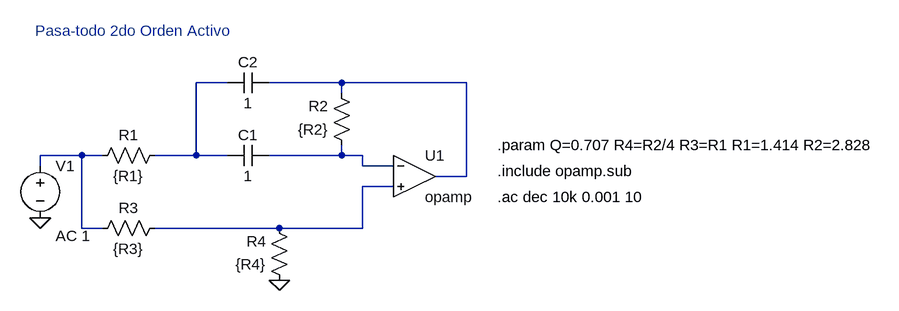
[diagram p0: schematic EJE2_C.asc]
EJE2_C.asc, the LTspice schematic file:
Version 4
SHEET 1 1232 680
WIRE 176 64 128 64
WIRE 352 64 240 64
WIRE 544 64 352 64
WIRE 352 80 352 64
WIRE -48 176 -112 176
WIRE -16 176 -48 176
WIRE 128 176 128 64
WIRE 128 176 64 176
WIRE 176 176 128 176
WIRE 352 176 352 160
WIRE 352 176 240 176
WIRE 384 176 352 176
WIRE -112 192 -112 176
WIRE 384 192 384 176
WIRE 432 192 384 192
WIRE 544 208 544 64
WIRE 544 208 496 208
WIRE 432 224 384 224
WIRE -48 288 -48 176
WIRE -16 288 -48 288
WIRE 256 288 64 288
WIRE 384 288 384 224
WIRE 384 288 256 288
FLAG 256 368 0
FLAG -112 272 0
SYMBOL res 80 160 R90
WINDOW 0 0 56 VBottom 2
WINDOW 3 32 56 VTop 2
SYMATTR InstName R1
SYMATTR Value {R1}
SYMBOL res 80 272 R90
WINDOW 0 0 56 VBottom 2
WINDOW 3 32 56 VTop 2
SYMATTR InstName R3
SYMATTR Value {R3}
SYMBOL res 272 384 R180
WINDOW 0 36 76 Left 2
WINDOW 3 36 40 Left 2
SYMATTR InstName R4
SYMATTR Value {R4}
SYMBOL cap 240 160 R90
WINDOW 0 0 32 VBottom 2
WINDOW 3 32 32 VTop 2
SYMATTR InstName C1
SYMATTR Value 1
SYMBOL cap 240 48 R90
WINDOW 0 0 32 VBottom 2
WINDOW 3 32 32 VTop 2
SYMATTR InstName C2
SYMATTR Value 1
SYMBOL res 368 176 R180
WINDOW 0 36 76 Left 2
WINDOW 3 36 40 Left 2
SYMATTR InstName R2
SYMATTR Value {R2}
SYMBOL OpAmps\\opamp 464 144 R0
SYMATTR InstName U1
SYMBOL voltage -112 176 R0
WINDOW 123 24 124 Left 2
WINDOW 39 0 0 Left 0
SYMATTR Value2 AC 1
SYMATTR InstName V1
SYMATTR Value ""
TEXT 592 160 Left 2 !.param Q=0.707 R4=R2/4 R3=R1 R1=1.414 R2=2.828
TEXT 592 240 Left 2 !.ac dec 10k 0.001 10
TEXT 592 200 Left 2 !.include opamp.sub
TEXT -120 -16 Left 2 ;Pasa-todo 2do Orden Activo

The netlist it stands for:
* EJE2_C.asc
R1 N001 N003 {R1}
R3 N005 N003 {R3}
R4 0 N005 {R4}
C1 N004 N001 1
C2 N002 N001 1
R2 N004 N002 {R2}
XU1 N004 N005 N002 opamp Aol=100K GBW=10Meg  ; pins invin noninvin out
V1 N003 0 AC 1
.param Q=0.707 R4=R2/4 R3=R1 R1=1.414 R2=2.828
.ac dec 10k 0.001 10
.include opamp.sub
* Pasa-todo 2do Orden Activo
.backanno
.end